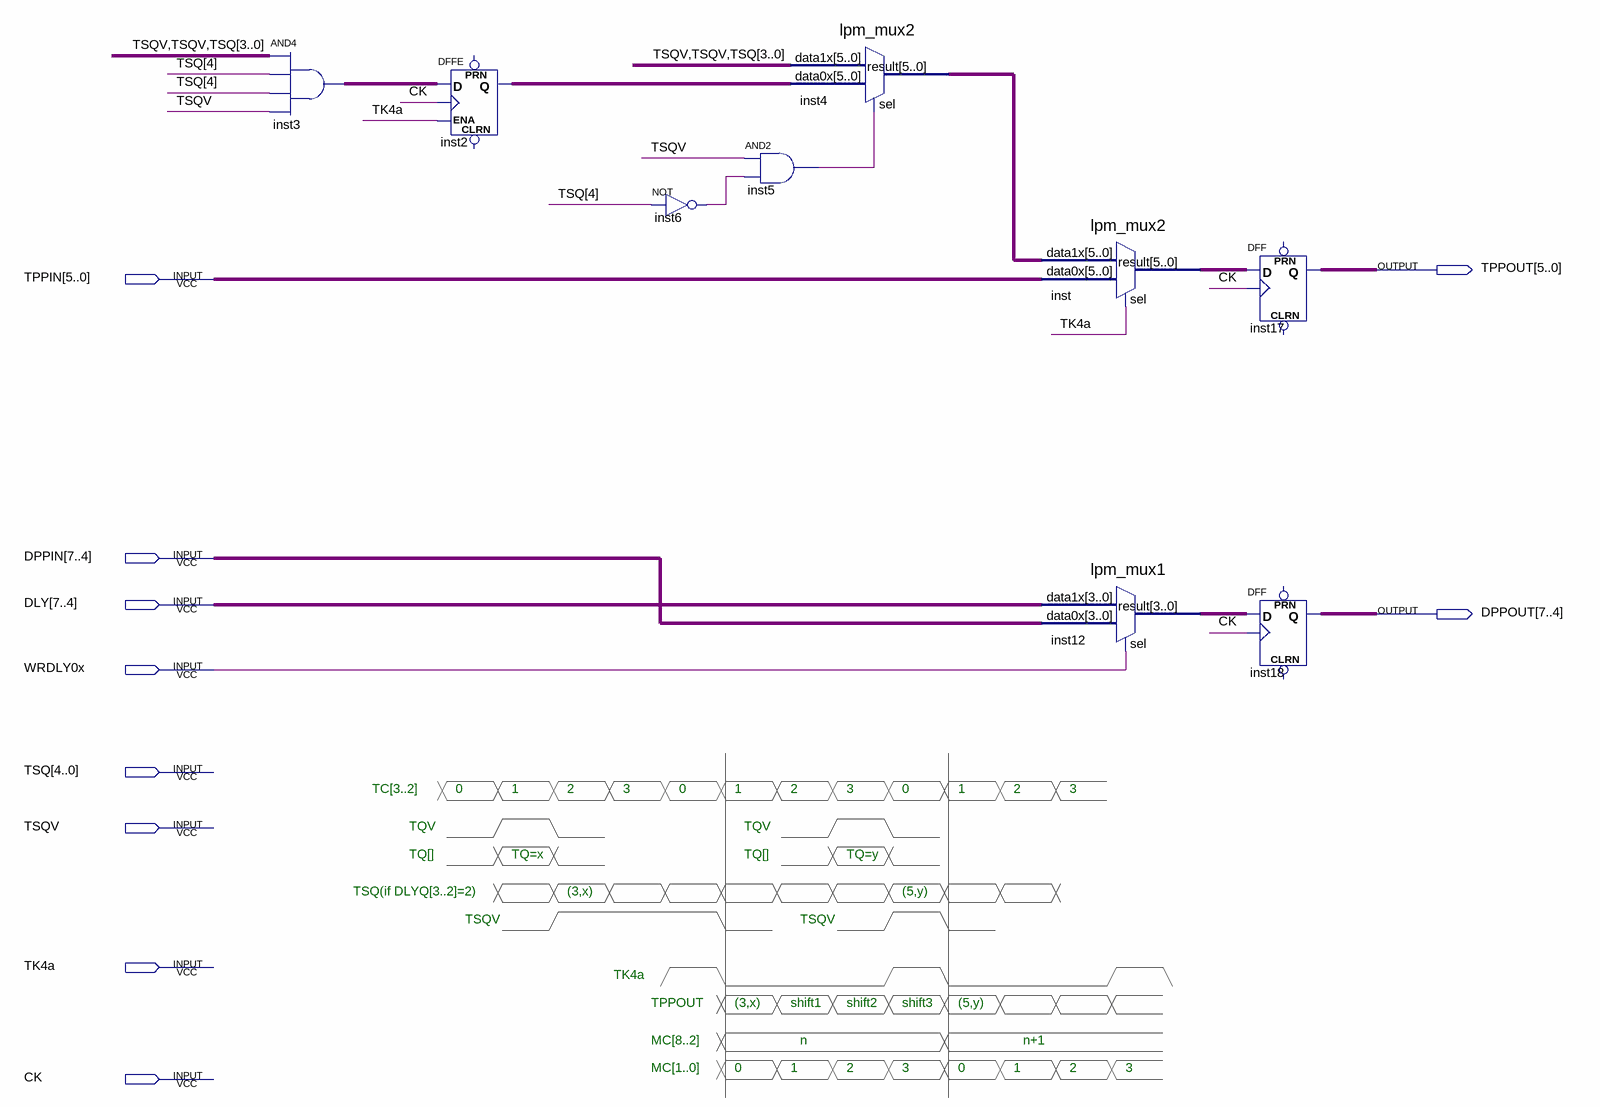
[diagram p0: schematic sheet]
// Quartus schematic OutPipe1a.bdf as structural Verilog: 9 symbols, 10 pins
module OutPipe1a (
  input  [5:0] TPPIN,
  input  [7:4] DPPIN,
  input  [7:4] DLY,
  input  WRDLY0x,
  input  [4:0] TSQ,
  input  TSQV,
  input  TK4a,
  input  CK,
  output [5:0] TPPOUT,
  output [7:4] DPPOUT
);

  wire inst5_out, inst6_out;
  wire [3:0] inst12_result;
  wire [5:0] inst2_q, inst3_out, inst4_result, inst_result;

  assign inst3_out = {{2{TSQV}}, TSQ[3:0]} & {6{TSQ[4]}} & {6{TSQ[4]}} & {6{TSQV}};  // AND4 inst3, 6 bits wide
  DFFE inst2[5:0] (.D(inst3_out), .CLK(CK), .ENA(TK4a), .Q(inst2_q));  // open: PRN, CLRN
  not inst6 (inst6_out, TSQ[4]);
  lpm_mux2 inst4 (.data1x({{2{TSQV}}, TSQ[3:0]}), .data0x(inst2_q), .sel(inst5_out), .result(inst4_result));
  and inst5 (inst5_out, TSQV, inst6_out);
  lpm_mux2 inst (.data1x(inst4_result), .data0x(TPPIN), .sel(TK4a), .result(inst_result));
  lpm_mux1 inst12 (.data1x(DLY), .data0x(DPPIN), .sel(WRDLY0x), .result(inst12_result));
  DFF inst17[5:0] (.CLK(CK), .D(inst_result), .Q(TPPOUT));  // open: CLRN, PRN
  DFF inst18[3:0] (.CLK(CK), .D(inst12_result), .Q(DPPOUT));  // open: CLRN, PRN

  // Notes on the sheet:
  //   TC[3..2]
  //   0
  //   1
  //   2
  //   3
  //   0
  //   1
  //   2
  //   3
  //   0
  //   1
  //   2
  //   3
  //   TQV
  //   TQV
  //   TQ[]
  //   TQ=x
  //   TQ[]
  //   TQ=y
  //   TSQ(if DLYQ[3..2]=2)
  //   (3,x)
  //   (5,y)
  //   TSQV
  //   TSQV
  //   TK4a
  //   TPPOUT
  //   (3,x)
  //   shift1
  //   shift2
  //   shift3
  //   (5,y)
  //   MC[8..2]
  //   n
  //   n+1
  //   MC[1..0]
  //   0
  //   1
  //   2
  //   3
  //   0
  //   1
  //   2
  //   3
endmodule
